# EAGLE schematic schaltplan_e (EAGLE 6.5.0)
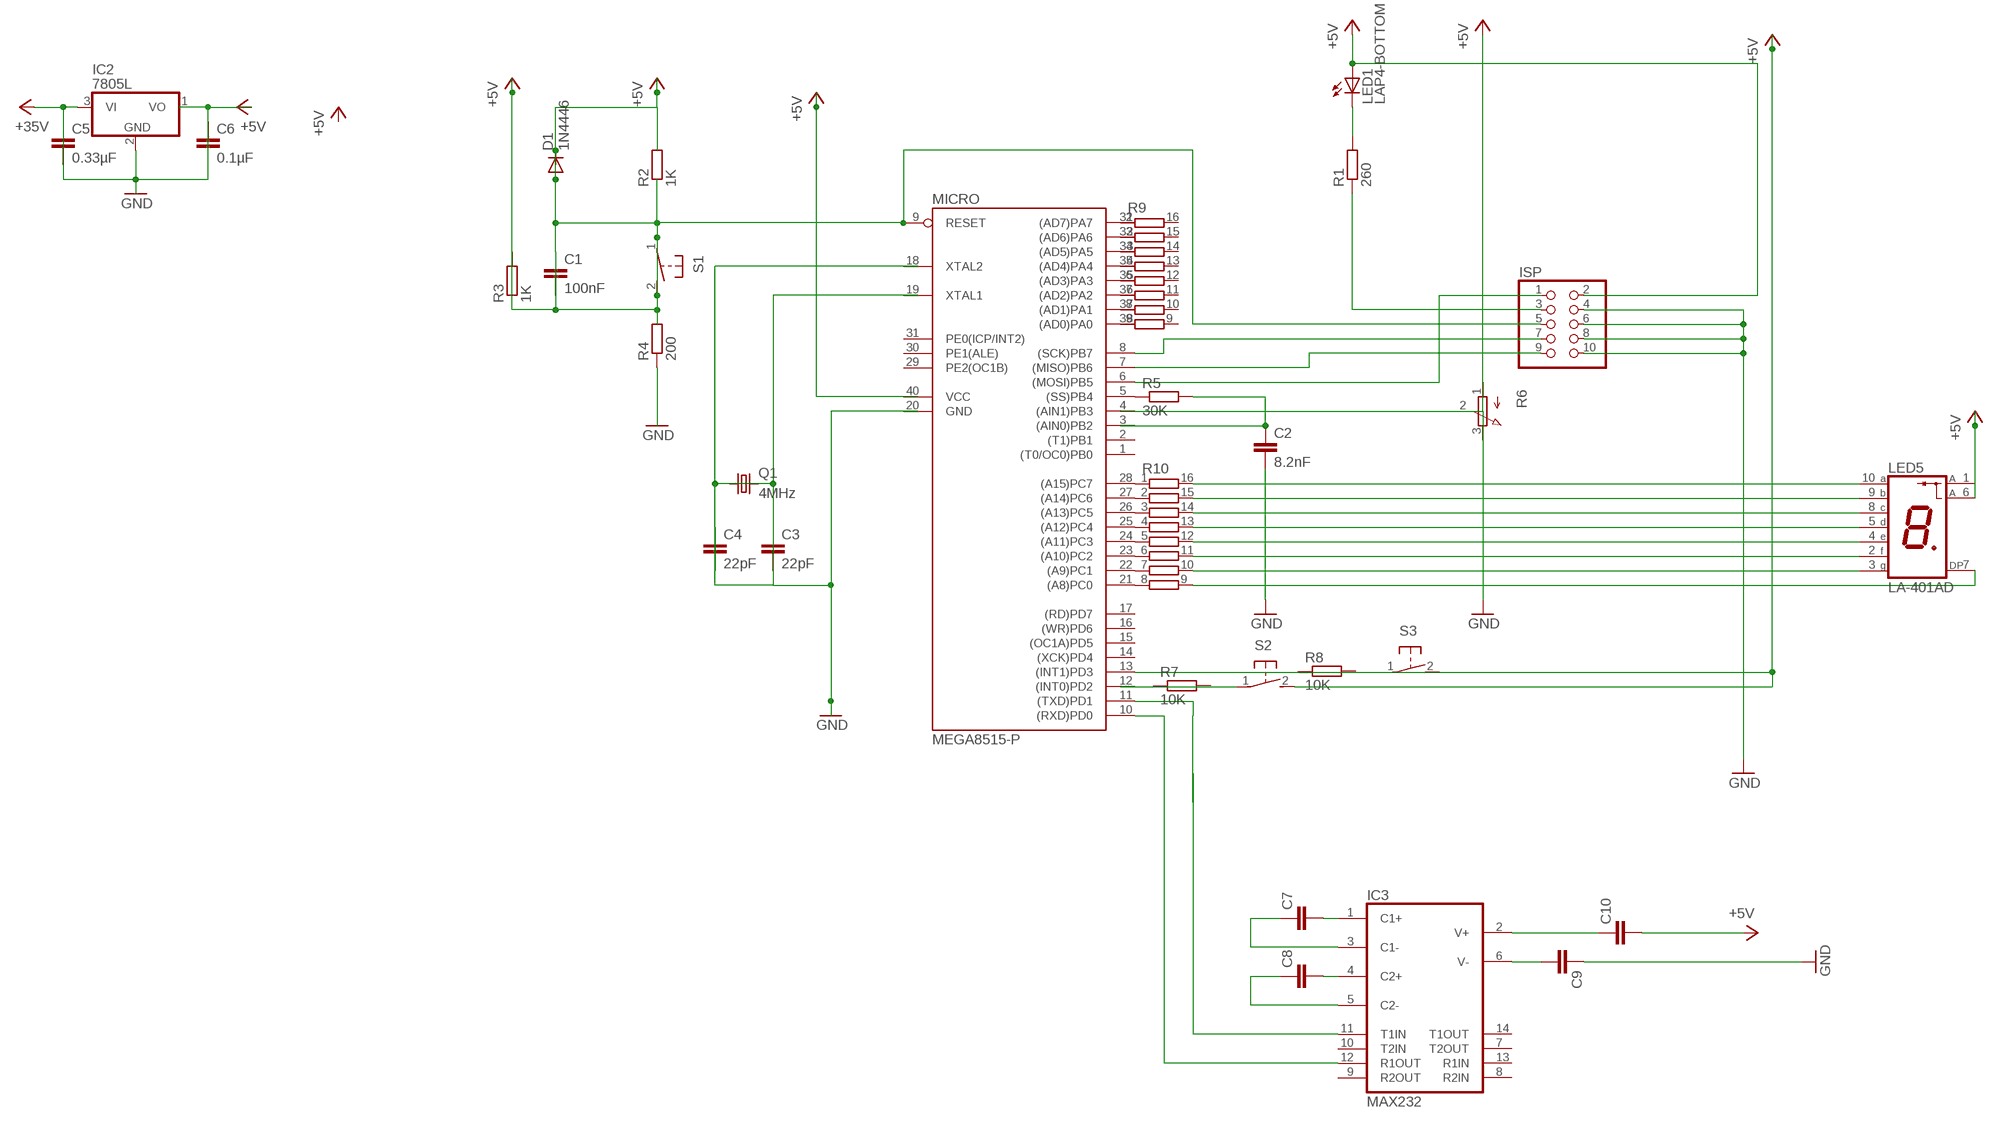
[diagram p0: schematic, sheet 1]

## Parts
C1  100nF  C-EU075-032X103  [C075-032X103]
C2  8.2nF  C-EU075-032X103  [C075-032X103]
C3  22pF  C-EU075-032X103  [C075-032X103]
C4  22pF  C-EU075-032X103  [C075-032X103]
C5  0.33µF  C-EU075-032X103  [C075-032X103]
C6  0.1µF  C-EU075-032X103  [C075-032X103]
C7  C-EU075-032X103  [C075-032X103]
C8  C-EU075-032X103  [C075-032X103]
C9  C-EU075-032X103  [C075-032X103]
C10  C-EU075-032X103  [C075-032X103]
D1  1N4446  [DO35-10]
IC2  7805L  [TO92]
IC3  MAX232  [DIL16]
ISP  PINHD-2X5  [2X05]
LED1  LAP4-BOTTOM  [P47F-BOTTOM]
LED5  LA-401AD  [LA-401]
MICRO  MEGA8515-P  [DIL40]
Q1  4MHz  CRYSTALHC49U-V  [HC49U-V]
R1  260  R-EU_0617/17  [0617/17]
R2  1K  R-EU_0617/17  [0617/17]
R3  1K  R-EU_0617/17  [0617/17]
R4  200  R-EU_0617/17  [0617/17]
R5  30K  R-EU_0617/17  [0617/17]
R6  3RP/1610N  [3RP/1610N]
R7  10K  R-EU_0414/15  [0414/15]
R8  10K  R-EU_0414/15  [0414/15]
R9  2NBS16-8  [SO16]
R10  2NBS16-8  [SO16]
S1  31-XX  [B3F-31XX]
S2  31-XX  [B3F-31XX]
S3  31-XX  [B3F-31XX]

## Nets
+5V: C1.1 C5.1 C10.2 D1.A D1.C IC2.2(GND) IC2.3(VI) ISP.2 ISP.5 LED1.A LED5.6(A) MICRO.9(RESET) MICRO.13((INT1)PD3) R3.1 R4.2 S1.1(P) S1.2(S) S2.2(S) S3.2(S) ; supply symbol labelled GND, +35V
GND: C2.2 C9.1 ISP.4 ISP.6 ISP.8 ISP.10
N$1: ISP.9 MICRO.7((MISO)PB6)
N$2: LED1.C R1.2
N$3: ISP.3 R1.1
N$5: ISP.7 MICRO.8((SCK)PB7)
N$6: ISP.1 MICRO.6((MOSI)PB5)
N$7: R4.1
N$8: MICRO.5((SS)PB4) R5.1
N$9: C2.1 R5.2
N$10: S2.1(P)
N$11: S3.1(P)
N$12: MICRO.28((A15)PC7) R10.1
N$13: C3.1 C3.2
N$14: MICRO.27((A14)PC6) R10.2
N$15: C4.1 C4.2
N$16: IC3.11(T1IN)
N$17: IC3.12(R1OUT) MICRO.10((RXD)PD0)
N$19: C7.1 IC3.3(C1-)
N$20: C8.1 IC3.5(C2-)
N$21: C7.2 IC3.1(C1+)
N$22: C8.2 IC3.4(C2+)
N$23: C9.2 IC3.6(V-)
N$24: C10.1 IC3.2(V+)
N$25: MICRO.11((TXD)PD1)
N$26: MICRO.26((A13)PC5) R10.3
N$27: MICRO.25((A12)PC4) R10.4
N$28: MICRO.24((A11)PC3) R10.5
N$29: MICRO.23((A10)PC2) R10.6
N$30: MICRO.22((A9)PC1) R10.7
N$31: MICRO.21((A8)PC0) R10.8
N$32: LED5.7(DP) R10.9
N$33: LED5.3(G) R10.10
N$34: LED5.2(F) R10.11
N$35: LED5.4(E) R10.12
N$36: LED5.5(D) R10.13
N$37: LED5.8(C) R10.14
N$38: LED5.9(B) R10.15
N$39: LED5.10(A) R10.16
Unconnected: C1.2 C5.2 C6.1 C6.2 IC2.1(VO) IC3.7(T2OUT) IC3.8(R2IN) IC3.9(R2OUT) IC3.10(T2IN) IC3.13(R1IN) IC3.14(T1OUT) LED5.1(A) MICRO.1((T0/OC0)PB0) MICRO.2((T1)PB1) MICRO.3((AIN0)PB2) MICRO.4((AIN1)PB3) MICRO.12((INT0)PD2) MICRO.14((XCK)PD4) MICRO.15((OC1A)PD5) MICRO.16((WR)PD6) MICRO.17((RD)PD7) MICRO.18(XTAL2) MICRO.19(XTAL1) MICRO.29(PE2(OC1B)) MICRO.30(PE1(ALE)) MICRO.31(PE0(ICP/INT2)) MICRO.32((AD7)PA7) MICRO.33((AD6)PA6) MICRO.34((AD5)PA5) MICRO.35((AD4)PA4) MICRO.36((AD3)PA3) MICRO.37((AD2)PA2) MICRO.38((AD1)PA1) MICRO.39((AD0)PA0) Q1.1 Q1.2 R2.1 R2.2 R3.2 R6.1(A) R6.2(S) R6.3(E) R7.1 R7.2 R8.1 R8.2 R9.1 R9.2 R9.3 R9.4 R9.5 R9.6 R9.7 R9.8 R9.9 R9.10 R9.11 R9.12 R9.13 R9.14 R9.15 R9.16

## Power pins joined to a net without a drawn wire
GND: IC3.15(GND) MICRO.20(GND)
VCC: IC3.16(VCC) MICRO.40(VCC)

## Library data of the parts
C1-C10 = resistor:C-EU: CAPACITOR, European symbol
D1 = diode:1N4446: DIODE high speed (Philips)
IC2 = linear:78*: Positive VOLTAGE REGULATOR Source: http://cache.national.com/ds/LM/LM78L05.pdf http://www.fairchildsemi.com/ds/LM/LM7805.pdf
IC3 = maxim:MAX232: RS232 TRANSCEIVER; MF: MAXIM; MPN: MAX232ACPE+; OC_FARNELL: 9723773; OC_NEWARK: 68K4544
ISP = pinhead:PINHD-2X5: PIN HEADER
LED1 = led:*P4: PointLED® Enhanced Thinfilm LED TOP & BOTTOM mount LS P47F, LR P47F, LA P47F, LY P47F, LT P4SG, LB P4SG, LW P4SG Source: http://catalog.osram-os.com .. LA_LR_LS_LY_P47F_Pb_free.pdf
LED5 = led-7-segment:LA-401*D: Single Digit LED Numeric Display (anode common) Source: ROHM .. la-1401dn.pdf; OC_FARNELL: unknown; OC_NEWARK: unknown
MICRO = atmel:MEGA8515-P: MICROCONTROLLER 8 Kbytes FLASH 512 bytes SRAM 512 bytes EEPROM USART 8-channel 10 bit ADC Source: avr.lbr; MPN: ATMEGA8515-16PU; OC_FARNELL: 9171401; OC_NEWARK: 01M6905
Q1 = crystal:CRYSTAL: CRYSTAL; OC_FARNELL: 1666969; OC_NEWARK: unknown
R1-R5 R7 R8 = resistor:R-EU_: RESISTOR, European symbol
R6 = pot:3RP/1610N: 16mm Potentiometer one level Source: http://www.alphapotentiometers.net/html/16mm_pot_2.html
R9 R10 = resistor-bourns:2NBS16-8: BOURNS RESISTOR NETWORK; OC_FARNELL: unknown; OC_NEWARK: unknown
S1-S3 = switch-omron:31-XX: OMRON SWITCH; MPN: B3F-3100; OC_FARNELL: 959704; OC_NEWARK: 36M3582